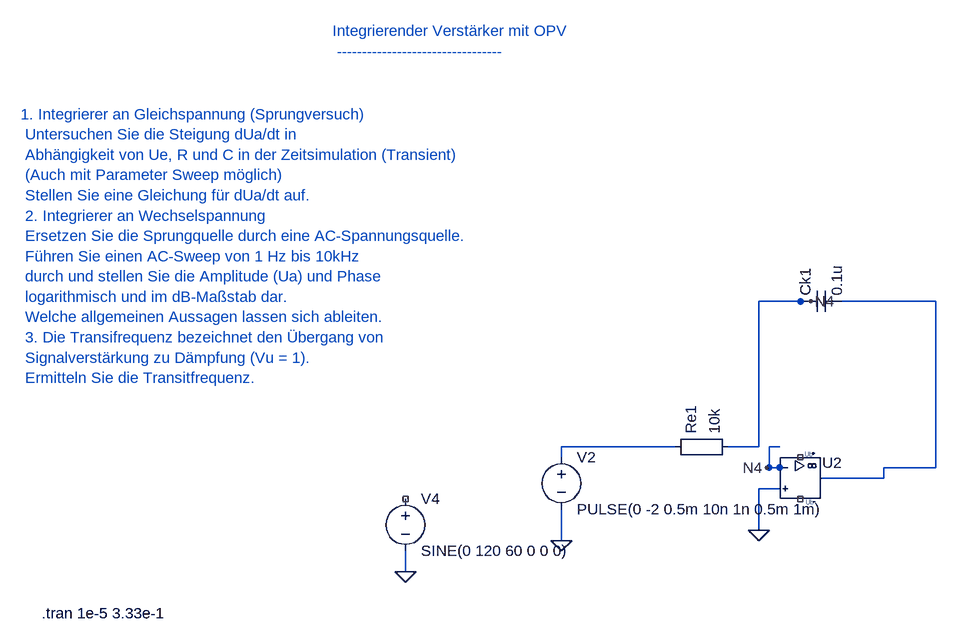
[diagram p0: schematic 7_1_1_Intergrierender_OPV.asc]
7_1_1_Intergrierender_OPV.asc, the LTspice schematic file:
Version 4
SHEET 1 880 680
WIRE 1296 496 1312 496
WIRE 1200 752 1184 752
WIRE 1184 752 1184 720
WIRE 1184 720 1200 720
WIRE 1264 768 1360 768
WIRE 1360 768 1360 752
WIRE 864 816 864 832
WIRE 624 880 624 896
WIRE 1232 496 1168 496
WIRE 1168 496 1168 720
WIRE 1168 720 1120 720
WIRE 1200 784 1168 784
WIRE 1168 784 1168 848
WIRE 1360 752 1440 752
WIRE 1440 752 1440 496
WIRE 1440 496 1312 496
WIRE 864 736 864 720
WIRE 864 720 1040 720
WIRE 864 832 864 864
WIRE 624 896 624 912
WIRE 1232 496 1248 496
WIRE 1200 752 1180 752
FLAG 1168 848 0
FLAG 864 864 0
FLAG 624 912 0
FLAG 1168 848 0
FLAG 864 864 0
FLAG 624 912 0
FLAG 1248 496 N4
FLAG 1180 752 N4
SYMBOL Misc\EuropeanResistor 1024 736 R270
SYMATTR InstName Re1
SYMATTR Value 10k
SYMBOL cap 1232 512 R270
SYMATTR InstName Ck1
SYMATTR Value 0.1u
SYMBOL UniversalOpAmp2 1232 768 R0
SYMATTR InstName U2
SYMATTR Value UniversalOpAmp2
SYMBOL voltage 864 720 R0
SYMATTR InstName V2
SYMATTR Value PULSE(0 -2 0.5m 10n 1n 0.5m 1m)
SYMBOL voltage 624 784 R0
SYMATTR InstName V4
SYMATTR Value SINE(0 120 60 0 0 0)
TEXT 64 976 Left 2 !.tran 1e-5 3.33e-1
TEXT 512 80 Left 2 ;Integrierender Verstärker mit OPV \n ---------------------------------
TEXT 32 208 Left 2 ;1. Integrierer an Gleichspannung (Sprungversuch) \n Untersuchen Sie die Steigung dUa/dt in \n Abhängigkeit von Ue, R und C in der Zeitsimulation (Transient) \n (Auch mit Parameter Sweep möglich) \n Stellen Sie eine Gleichung für dUa/dt auf. \n 2. Integrierer an Wechselspannung \n Ersetzen Sie die Sprungquelle durch eine AC-Spannungsquelle. \n Führen Sie einen AC-Sweep von 1 Hz bis 10kHz \n durch und stellen Sie die Amplitude (Ua) und Phase \n logarithmisch und im dB-Maßstab dar. \n Welche allgemeinen Aussagen lassen sich ableiten. \n 3. Die Transifrequenz bezeichnet den Übergang von \n Signalverstärkung zu Dämpfung (Vu = 1). \n Ermitteln Sie die Transitfrequenz.

The netlist it stands for:
* 7_1_1_Intergrierender_OPV.asc
Re1 N002 N4 10k
Ck1 N4 N001 0.1u
XU2 0 N4 NC_01 NC_02 N001 level2 UniversalOpAmp2 Avol=1Meg GBW=10Meg Slew=10Meg Ilimit=25m Rail=0 Vos=0 En=0 Enk=0 In=0 Ink=0 Rin=500Meg  ; pins In+ In- V+ V- OUT
V2 N002 0 PULSE(0 -2 0.5m 10n 1n 0.5m 1m)
V4 NC_03 0 SINE(0 120 60 0 0 0)
.tran 1e-5 3.33e-1
* Integrierender Verstärker mit OPV
*  ---------------------------------
* 1. Integrierer an Gleichspannung (Sprungversuch)
*  Untersuchen Sie die Steigung dUa/dt in
*  Abhängigkeit von Ue, R und C in der Zeitsimulation (Transient)
*  (Auch mit Parameter Sweep möglich)
*  Stellen Sie eine Gleichung für dUa/dt auf.
*  2. Integrierer an Wechselspannung
*  Ersetzen Sie die Sprungquelle durch eine AC-Spannungsquelle.
*  Führen Sie einen AC-Sweep von 1 Hz bis 10kHz
*  durch und stellen Sie die Amplitude (Ua) und Phase
*  logarithmisch und im dB-Maßstab dar.
*  Welche allgemeinen Aussagen lassen sich ableiten.
*  3. Die Transifrequenz bezeichnet den Übergang von
*  Signalverstärkung zu Dämpfung (Vu = 1).
*  Ermitteln Sie die Transitfrequenz.
.lib UniversalOpAmp2.lib
.backanno
.end